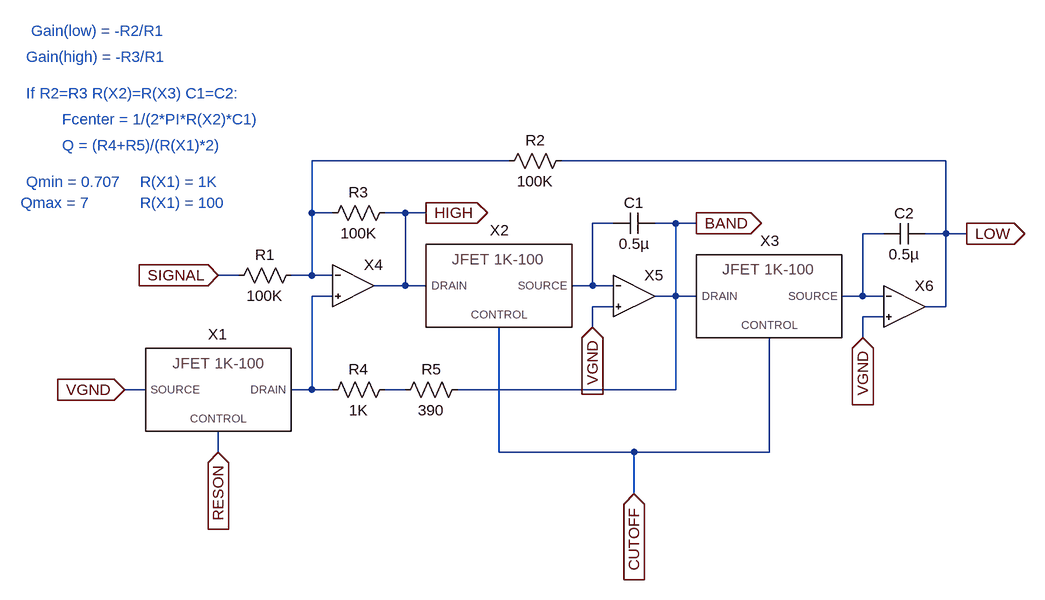
[diagram p0: schematic filter.asc]
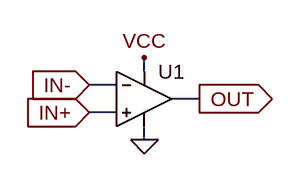
[diagram p1: sub-circuit opamp.asc]
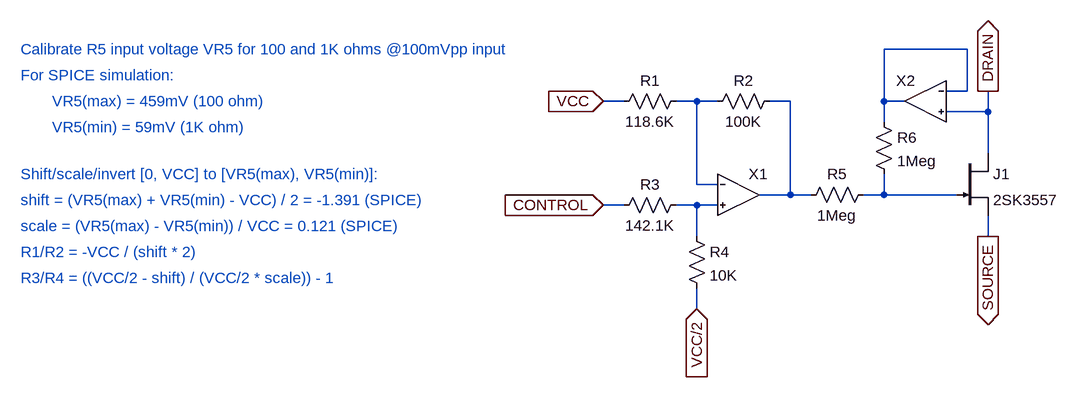
[diagram p2: sub-circuit jfet_1k_100.asc]
filter.asc, the LTspice schematic file:
Version 4
SHEET 1 1624 1400
WIRE 96 48 -208 48
WIRE 768 48 176 48
WIRE -208 128 -208 48
WIRE -176 128 -208 128
WIRE -64 128 -96 128
WIRE -32 128 -64 128
WIRE 256 144 224 144
WIRE 352 144 320 144
WIRE 384 144 352 144
WIRE 672 160 640 160
WIRE 768 160 768 48
WIRE 768 160 736 160
WIRE 800 160 768 160
WIRE -320 224 -352 224
WIRE -208 224 -208 128
WIRE -208 224 -240 224
WIRE -176 224 -208 224
WIRE -64 240 -64 128
WIRE -64 240 -112 240
WIRE -32 240 -64 240
WIRE 224 240 224 144
WIRE 224 240 192 240
WIRE 256 240 224 240
WIRE -176 256 -208 256
WIRE 352 256 352 144
WIRE 352 256 320 256
WIRE 384 256 352 256
WIRE 640 256 640 160
WIRE 640 256 608 256
WIRE 672 256 640 256
WIRE 256 272 224 272
WIRE 768 272 768 160
WIRE 768 272 736 272
WIRE 672 288 640 288
WIRE 224 304 224 272
WIRE 640 320 640 288
WIRE -464 400 -496 400
WIRE -208 400 -208 256
WIRE -208 400 -240 400
WIRE -176 400 -208 400
WIRE -64 400 -96 400
WIRE 352 400 352 256
WIRE 352 400 16 400
WIRE -352 496 -352 464
WIRE 80 496 80 304
WIRE 288 496 80 496
WIRE 496 496 496 320
WIRE 496 496 288 496
WIRE 288 560 288 496
FLAG -352 224 SIGNAL
IOPIN -352 224 In
FLAG 224 304 VGND
IOPIN 224 304 In
FLAG 640 320 VGND
IOPIN 640 320 In
FLAG -32 128 HIGH
IOPIN -32 128 Out
FLAG 384 144 BAND
IOPIN 384 144 Out
FLAG 800 160 LOW
IOPIN 800 160 Out
FLAG -496 400 VGND
IOPIN -496 400 In
FLAG -352 496 RESON
IOPIN -352 496 In
FLAG 288 560 CUTOFF
IOPIN 288 560 In
SYMBOL cap 320 128 R90
WINDOW 0 0 32 VBottom 2
WINDOW 3 32 32 VTop 2
SYMATTR InstName C1
SYMATTR Value 0.5µ
SYMBOL cap 736 144 R90
WINDOW 0 0 32 VBottom 2
WINDOW 3 32 32 VTop 2
SYMATTR InstName C2
SYMATTR Value 0.5µ
SYMBOL res -80 112 R90
WINDOW 0 0 56 VBottom 2
WINDOW 3 32 56 VTop 2
SYMATTR InstName R3
SYMATTR Value 100K
SYMBOL res 192 32 R90
WINDOW 0 0 56 VBottom 2
WINDOW 3 32 56 VTop 2
SYMATTR InstName R2
SYMATTR Value 100K
SYMBOL res -224 208 R90
WINDOW 0 0 56 VBottom 2
WINDOW 3 32 56 VTop 2
SYMATTR InstName R1
SYMATTR Value 100K
SYMBOL opamp -144 240 R0
SYMATTR InstName X4
SYMBOL opamp 288 256 R0
SYMATTR InstName X5
SYMBOL opamp 704 272 R0
SYMATTR InstName X6
SYMBOL res -80 384 R90
WINDOW 0 0 56 VBottom 2
WINDOW 3 32 56 VTop 2
SYMATTR InstName R4
SYMATTR Value 1K
SYMBOL jfet_1k_100 -352 400 M0
SYMATTR InstName X1
SYMBOL jfet_1k_100 80 240 R0
SYMATTR InstName X2
SYMBOL jfet_1k_100 496 256 R0
SYMATTR InstName X3
SYMBOL res 32 384 R90
WINDOW 0 0 56 VBottom 2
WINDOW 3 32 56 VTop 2
SYMATTR InstName R5
SYMATTR Value 390
TEXT -640 -152 Left 2 ;Gain(low) = -R2/R1
TEXT -648 -112 Left 2 ;Gain(high) = -R3/R1
TEXT -648 -56 Left 2 ;If R2=R3 R(X2)=R(X3) C1=C2:
TEXT -592 -16 Left 2 ;Fcenter = 1/(2*PI*R(X2)*C1)
TEXT -592 24 Left 2 ;Q = (R4+R5)/(R(X1)*2)
TEXT -648 80 Left 2 ;Qmin = 0.707
TEXT -656 112 Left 2 ;Qmax = 7
TEXT -472 80 Left 2 ;R(X1) = 1K
TEXT -472 112 Left 2 ;R(X1) = 100

opamp.asc, the sub-circuit schematic file:
Version 4
SHEET 1 880 680
WIRE 144 144 144 128
WIRE 112 160 80 160
WIRE 208 176 176 176
WIRE 112 192 80 192
WIRE 144 224 144 208
FLAG 144 224 0
FLAG 144 128 VCC
FLAG 208 176 OUT
IOPIN 208 176 Out
FLAG 80 192 IN+
IOPIN 80 192 In
FLAG 80 160 IN-
IOPIN 80 160 In
SYMBOL Opamps\\UniversalOpamp2 144 176 R0
SYMATTR InstName U1
SYMATTR Value2 Avol=1Meg GBW=1.2Meg Slew=10Meg

jfet_1k_100.asc, the sub-circuit schematic file:
Version 4
SHEET 1 1080 680
WIRE 352 -256 224 -256
WIRE 352 -192 352 -256
WIRE 352 -192 320 -192
WIRE -176 -176 -208 -176
WIRE -64 -176 -96 -176
WIRE -32 -176 -64 -176
WIRE 80 -176 48 -176
WIRE 224 -176 224 -256
WIRE 256 -176 224 -176
WIRE 384 -160 384 -192
WIRE 384 -160 320 -160
WIRE 224 -144 224 -176
WIRE 384 -96 384 -160
WIRE -64 -48 -64 -176
WIRE -32 -48 -64 -48
WIRE 80 -32 80 -176
WIRE 80 -32 32 -32
WIRE 112 -32 80 -32
WIRE 224 -32 224 -64
WIRE 224 -32 192 -32
WIRE 336 -32 224 -32
WIRE -176 -16 -208 -16
WIRE -64 -16 -96 -16
WIRE -32 -16 -64 -16
WIRE -64 32 -64 -16
WIRE 384 32 384 0
WIRE -64 144 -64 112
FLAG -208 -16 CONTROL
IOPIN -208 -16 In
FLAG 384 32 SOURCE
IOPIN 384 32 Out
FLAG 384 -192 DRAIN
IOPIN 384 -192 Out
FLAG -208 -176 VCC
IOPIN -208 -176 In
FLAG -64 144 VCC/2
IOPIN -64 144 In
SYMBOL res -80 -192 R90
WINDOW 0 0 56 VBottom 2
WINDOW 3 32 56 VTop 2
SYMATTR InstName R1
SYMATTR Value 118.6K
SYMBOL res 64 -192 R90
WINDOW 0 0 56 VBottom 2
WINDOW 3 32 56 VTop 2
SYMATTR InstName R2
SYMATTR Value 100K
SYMBOL res -80 -32 R90
WINDOW 0 0 56 VBottom 2
WINDOW 3 32 56 VTop 2
SYMATTR InstName R3
SYMATTR Value 142.1K
SYMBOL res -80 16 R0
SYMATTR InstName R4
SYMATTR Value 10K
SYMBOL res 208 -48 R90
WINDOW 0 0 56 VBottom 2
WINDOW 3 32 56 VTop 2
SYMATTR InstName R5
SYMATTR Value 1Meg
SYMBOL njf 336 -96 R0
SYMATTR InstName J1
SYMATTR Value 2SK3557
SYMBOL res 208 -160 R0
SYMATTR InstName R6
SYMATTR Value 1Meg
SYMBOL opamp 0 -32 R0
SYMATTR InstName X1
SYMBOL opamp 288 -176 M0
SYMATTR InstName X2
TEXT -1104 -256 Left 2 ;Calibrate R5 input voltage VR5 for 100 and 1K ohms @100mVpp input
TEXT -1104 -216 Left 2 ;For SPICE simulation:
TEXT -1104 -24 Left 2 ;shift = (VR5(max) + VR5(min) - VCC) / 2 = -1.391 (SPICE)
TEXT -1104 -64 Left 2 ;Shift/scale/invert [0, VCC] to [VR5(max), VR5(min)]:
TEXT -1104 16 Left 2 ;scale = (VR5(max) - VR5(min)) / VCC = 0.121 (SPICE)
TEXT -1104 56 Left 2 ;R1/R2 = -VCC / (shift * 2)
TEXT -1104 96 Left 2 ;R3/R4 = ((VCC/2 - shift) / (VCC/2 * scale)) - 1
TEXT -1056 -176 Left 2 ;VR5(max) = 459mV (100 ohm)
TEXT -1056 -136 Left 2 ;VR5(min) = 59mV (1K ohm)

The netlist it stands for:
* filter.asc
C1 BAND N002 0.5µ
C2 LOW N003 0.5µ
R3 HIGH N001 100K
R2 LOW N001 100K
R1 N001 SIGNAL 100K
XX4 N004 N001 HIGH opamp
XX5 VGND N002 BAND opamp
XX6 VGND N003 LOW opamp
R4 N005 N004 1K
XX1 N004 VGND RESON jfet_1k_100
XX2 HIGH N002 CUTOFF jfet_1k_100
XX3 BAND N003 CUTOFF jfet_1k_100
R5 BAND N005 390

* block symbol definitions
.subckt opamp IN+ IN- OUT
XU1 IN+ IN- VCC 0 OUT level.2 Avol=1Meg GBW=1.2Meg Slew=10Meg ilimit=25m rail=0 Vos=0 phimargin=45 en=0 enk=0 in=0 ink=0 Rin=500Meg  ; pins IN+ IN- V+ V- OUT
.ends opamp

.subckt jfet_1k_100 DRAIN SOURCE CONTROL
R1 N002 VCC 118.6K
R2 N003 N002 100K
R3 N005 CONTROL 142.1K
R4 N005 VCC/2 10K
R5 N004 N003 1Meg
J1 DRAIN N004 SOURCE 2SK3557
R6 N001 N004 1Meg
XX1 N005 N002 N003 opamp
XX2 DRAIN N001 N001 opamp
* Calibrate R5 input voltage VR5 for 100 and 1K ohms @100mVpp input
* For SPICE simulation:
* shift = (VR5(max) + VR5(min) - VCC) / 2 = -1.391 (SPICE)
* Shift/scale/invert [0, VCC] to [VR5(max), VR5(min)]:
* scale = (VR5(max) - VR5(min)) / VCC = 0.121 (SPICE)
* R1/R2 = -VCC / (shift * 2)
* R3/R4 = ((VCC/2 - shift) / (VCC/2 * scale)) - 1
* VR5(max) = 459mV (100 ohm)
* VR5(min) = 59mV (1K ohm)
.ends jfet_1k_100

.model NJF NJF
.model PJF PJF
.lib standard.jft
* Gain(low) = -R2/R1
* Gain(high) = -R3/R1
* If R2=R3 R(X2)=R(X3) C1=C2:
* Fcenter = 1/(2*PI*R(X2)*C1)
* Q = (R4+R5)/(R(X1)*2)
* Qmin = 0.707
* Qmax = 7
* R(X1) = 1K
* R(X1) = 100
.lib UniversalOpamps2.sub
.backanno
.end